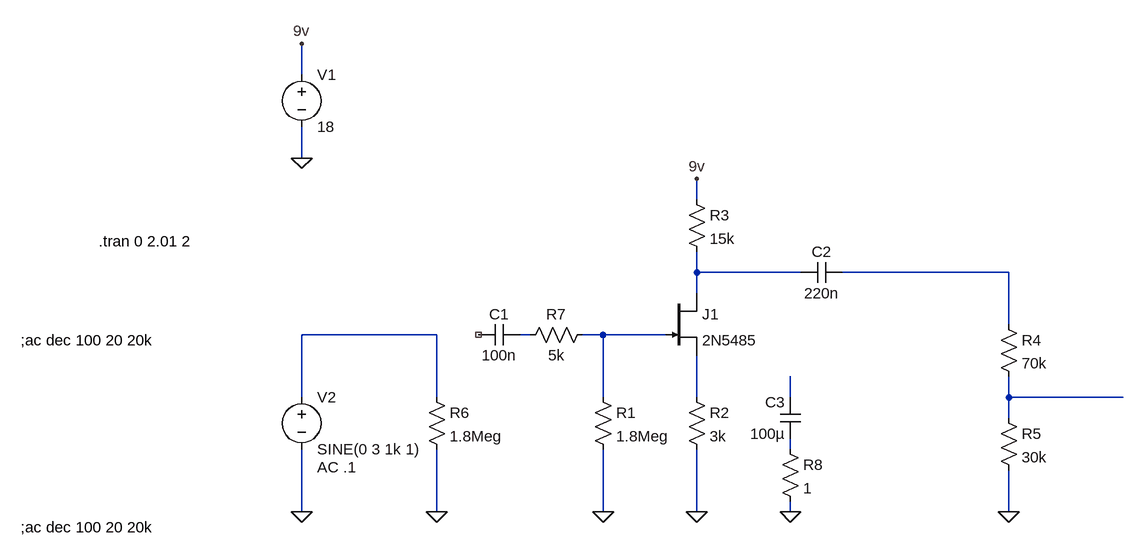
[diagram p0: schematic JFET_Single_Stage.asc]
JFET_Single_Stage.asc, the LTspice schematic file:
Version 4
SHEET 1 884 680
WIRE -384 -224 -384 -272
WIRE -384 -96 -384 -144
WIRE 224 -32 224 -64
WIRE 224 80 224 48
WIRE 384 80 224 80
WIRE 704 80 448 80
WIRE 224 112 224 80
WIRE 704 160 704 80
WIRE -176 176 -384 176
WIRE -32 176 -48 176
WIRE 80 176 48 176
WIRE 176 176 80 176
WIRE -384 272 -384 176
WIRE -176 272 -176 176
WIRE 80 272 80 176
WIRE 224 272 224 208
WIRE 368 272 368 240
WIRE 704 272 704 240
WIRE 880 272 704 272
WIRE 704 304 704 272
WIRE 368 352 368 336
WIRE -384 448 -384 352
WIRE -176 448 -176 352
WIRE 80 448 80 352
WIRE 224 448 224 352
WIRE 368 448 368 432
WIRE 704 448 704 384
FLAG 224 448 0
FLAG 80 448 0
FLAG 368 448 0
FLAG -384 -96 0
FLAG -384 448 0
FLAG -384 -272 9v
FLAG 224 -64 9v
FLAG 704 448 0
FLAG -176 448 0
DATAFLAG -288 176 ""
DATAFLAG 224 80 ""
DATAFLAG 224 240 ""
SYMBOL njf 176 112 R0
SYMATTR InstName J1
SYMATTR Value 2N5485
SYMBOL cap -48 160 R90
WINDOW 0 0 32 VBottom 2
WINDOW 3 32 32 VTop 2
SYMATTR InstName C1
SYMATTR Value 100n
SYMBOL res 64 256 R0
SYMATTR InstName R1
SYMATTR Value 1.8Meg
SYMBOL res 208 256 R0
SYMATTR InstName R2
SYMATTR Value 3k
SYMBOL res 208 -48 R0
SYMATTR InstName R3
SYMATTR Value 15k
SYMBOL cap 448 64 R90
WINDOW 0 0 32 VBottom 2
WINDOW 3 32 32 VTop 2
SYMATTR InstName C2
SYMATTR Value 220n
SYMBOL cap 384 336 R180
WINDOW 0 24 56 Left 2
WINDOW 3 24 8 Left 2
SYMATTR InstName C3
SYMATTR Value 100µ
SYMBOL voltage -384 -240 R0
WINDOW 123 0 0 Left 2
WINDOW 39 0 0 Left 2
SYMATTR InstName V1
SYMATTR Value 18
SYMBOL voltage -384 256 R0
WINDOW 123 24 124 Left 2
WINDOW 39 0 0 Left 2
SYMATTR Value2 AC .1
SYMATTR InstName V2
SYMATTR Value SINE(0 3 1k 1)
SYMBOL res 688 144 R0
SYMATTR InstName R4
SYMATTR Value 70k
SYMBOL res 688 288 R0
SYMATTR InstName R5
SYMATTR Value 30k
SYMBOL res -192 256 R0
SYMATTR InstName R6
SYMATTR Value 1.8Meg
SYMBOL res 64 160 R90
WINDOW 0 0 56 VBottom 2
WINDOW 3 32 56 VTop 2
SYMATTR InstName R7
SYMATTR Value 5k
SYMBOL res 352 336 R0
SYMATTR InstName R8
SYMATTR Value 1
TEXT -816 184 Left 2 !;ac dec 100 20 20k
TEXT -816 472 Left 2 !;ac dec 100 20 20k
TEXT -696 32 Left 2 !.tran 0 2.01 2

The netlist it stands for:
* JFET_Single_Stage.asc
J1 N001 N005 N006 2N5485
C1 N004 NC_01 100n
R1 N005 0 1.8Meg
R2 N006 0 3k
R3 9v N001 15k
C2 N002 N001 220n
C3 N009 N007 100µ
V1 9v 0 18
V2 N003 0 SINE(0 3 1k 1) AC .1
R4 N002 N008 70k
R5 N008 0 30k
R6 N003 0 1.8Meg
R7 N005 N004 5k
R8 N009 0 1
.model NJF NJF
.model PJF PJF
.lib standard.jft
;ac dec 100 20 20k
;ac dec 100 20 20k
.tran 0 2.01 2
.backanno
.end